# Altium schematic sheet EndStops.SchDoc
size B
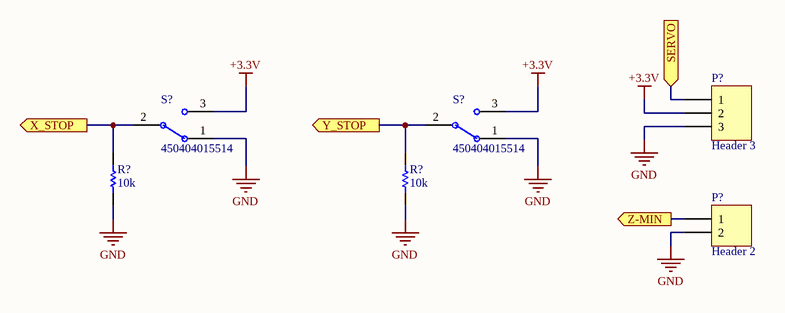
[diagram p0: EndStops.SchDoc]

## Parts
(Parts that share a designator on the sheet are numbered #1, #2 ... from top to bottom, then left to right.)
P?#1  Header 3  [HDR1X3]
P?#2  Header 2  [HDR1X2]
R?#1  value 10k  [AXIAL-0.3]  (hidden comment: Res1)
R?#2  value 10k  [AXIAL-0.3]  (hidden comment: Res1)
S?#1  450404015514  [WURTH WS-SLSU 450404015514]
S?#2  450404015514  [WURTH WS-SLSU 450404015514]

## Ports
SERVO (in), X_STOP (out), Y_STOP (out), Z-MIN (out)

## Nets
+3.3V: P?#1.2 S?#1.3 S?#2.3
GND: P?#1.3 P?#2.2 R?#1.1 R?#2.1 S?#1.1 S?#2.1
SERVO: P?#1.1 ; port SERVO
X_STOP: R?#1.2 S?#1.2(COM) ; port X_STOP
Y_STOP: R?#2.2 S?#2.2(COM) ; port Y_STOP
Z-MIN: P?#2.1 ; port Z-MIN

## Library data of the parts
P?#1 = Header 3: Header, 3-Pin; LatestRevisionDate: 17-Jul-2002; LatestRevisionNote: Re-released for DXP Platform.; Publisher: Altium Limited
P?#2 = Header 2: Header, 2-Pin; LatestRevisionDate: 17-Jul-2002; LatestRevisionNote: Re-released for DXP Platform.; Publisher: Altium Limited
R?#1 R?#2 = Res1: Resistor; Published: 8-Jun-2000; LatestRevisionDate: 17-Jul-2002; LatestRevisionNote: Re-released for DXP Platform.; PackageReference: AXIAL-0.3; Publisher: Altium Limited; PackageDescription: Axial Device, Thru-Hole; 2 Leads; 0.3 in Pin Spacing
S?#1 S?#2 = 450404015514: MINI SLIDE SWITCH 6.7 X 2.7 MM.; Manufacturer: Würth Elektronik; Rated Current: 300mA; Rated Voltage: 5VDC; Switching Function: On-On; Circuit: SPDT; Actuator Length: 1.50mm; Actuator Type: Standard; Contact Timing: Non-Shorting (BBM); Current Rating (Amps): 300mA (DC); Voltage Rating - DC: 5 V; ComponentLink1Description: Datasheet; ComponentLink1URL: https://katalog.we-online.de/em/datasheet/450404015514.pdf; ComponentLink2Description: DigiKey Link; ComponentLink2URL: https://www.digikey.com/en/products/detail/würth-elektronik/450404015514/9950812; Packaging: TapeAndReel; Publisher: Wurth Elektronik; Contact Material: Copper Alloy; Mounting Technology: SMT; Operating Temperature: -40°C ~ 85°C; Contact Plating: Silver; Part Number: 450404015514; Published Date: September 2019; Terminal Material: Copper Alloy; Size: 6.7x2.7mm; Terminal Plating: Silver; Contact Finish: Silver; LastUpdated: 20.06.2022 13:21:56; Lifecycle Status: Active; Minimum Order: 1; Mounting Type: Surface Mount; PartId: 5; Part Status: Active; Price: 0.48; Series: WS-SLSU; Supplier 1: DigiKey; Supplier Part Number 1: 732-13665-1-ND; Switch Function: On-On; Termination Style: SMD (SMT) Tab